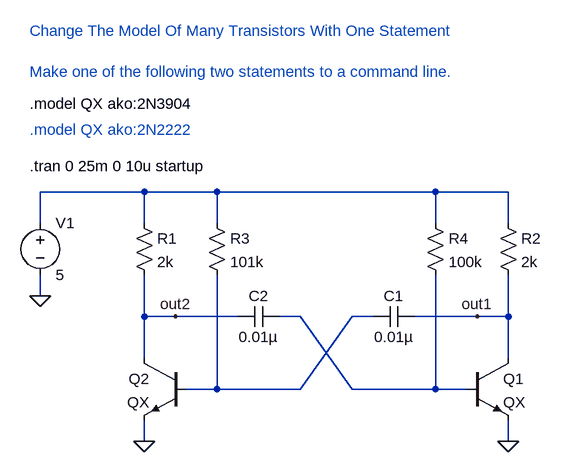
[diagram p0: schematic Model_Selection_ako.asc]
Model_Selection_ako.asc, the LTspice schematic file:
Version 4
SHEET 1 956 680
WIRE -32 240 -32 304
WIRE 80 416 208 416
WIRE 528 368 528 304
WIRE 528 160 528 112
WIRE 528 112 416 112
WIRE -32 112 -32 160
WIRE 528 304 528 240
WIRE -32 368 -32 304
WIRE 528 464 528 496
WIRE -32 496 -32 464
WIRE 288 416 416 416
WIRE 384 304 480 304
WIRE 320 304 288 304
WIRE 288 304 208 416
WIRE 112 304 16 304
WIRE 176 304 208 304
WIRE 208 304 288 416
WIRE -32 112 -192 112
WIRE -192 112 -192 160
WIRE -192 240 -192 272
WIRE 80 112 -32 112
WIRE 416 160 416 112
WIRE 416 112 80 112
WIRE 416 240 416 416
WIRE 416 416 464 416
WIRE 80 240 80 416
WIRE 80 416 32 416
WIRE 80 160 80 112
WIRE 480 304 528 304
WIRE 16 304 -32 304
FLAG 528 496 0
FLAG -32 496 0
FLAG -192 272 0
FLAG 480 304 out1
FLAG 16 304 out2
SYMBOL res -48 144 R0
SYMATTR InstName R1
SYMATTR Value 2k
SYMBOL res 512 144 R0
SYMATTR InstName R2
SYMATTR Value 2k
SYMBOL res 64 144 R0
SYMATTR InstName R3
SYMATTR Value 101k
SYMBOL npn 464 368 R0
SYMATTR InstName Q1
SYMATTR Value QX
SYMBOL res 400 144 R0
SYMATTR InstName R4
SYMATTR Value 100k
SYMBOL npn 32 368 M0
SYMATTR InstName Q2
SYMATTR Value QX
SYMBOL cap 320 320 R270
WINDOW 0 32 32 VTop 0
WINDOW 3 0 32 VBottom 0
SYMATTR InstName C1
SYMATTR Value 0.01µ
SYMBOL cap 112 320 R270
WINDOW 0 32 32 VTop 0
WINDOW 3 0 32 VBottom 0
SYMATTR InstName C2
SYMATTR Value 0.01µ
SYMBOL voltage -192 144 R0
SYMATTR InstName V1
SYMATTR Value 5
TEXT -208 72 Left 0 !.tran 0 25m 0 10u startup
TEXT -208 -24 Left 0 !.model QX ako:2N3904
TEXT -208 16 Left 0 ;.model QX ako:2N2222
TEXT -208 -136 Left 0 ;Change The Model Of Many Transistors With One Statement\n \nMake one of the following two statements to a command line.

The netlist it stands for:
* Model_Selection_ako.asc
R1 N002 out2 2k
R2 N002 out1 2k
R3 N002 N001 101k
Q1 out1 N003 0 0 QX
R4 N002 N003 100k
Q2 out2 N001 0 0 QX
C1 N001 out1 0.01µ
C2 out2 N003 0.01µ
V1 N002 0 5
.model NPN NPN
.model PNP PNP
.lib standard.bjt
.tran 0 25m 0 10u startup
.model QX ako:2N3904
* .model QX ako:2N2222
* Change The Model Of Many Transistors With One Statement
* Make one of the following two statements to a command line.
.backanno
.end